# EAGLE schematic ControlInputs (EAGLE 7.5.0)
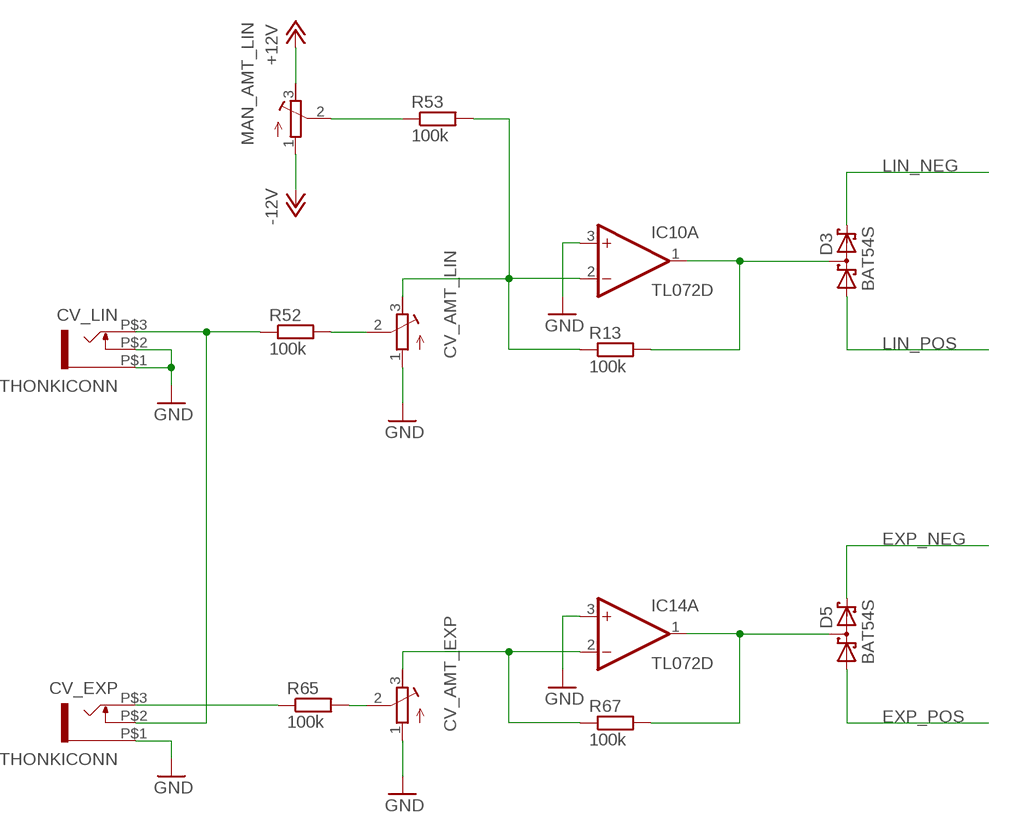
[diagram p0: schematic, sheet 1]

## Parts
CV_AMT_EXP  R-TRIMM64X  [RTRIM64X]
CV_AMT_LIN  R-TRIMM64X  [RTRIM64X]
CV_EXP  THONKICONN  [THONKICONN]
CV_LIN  THONKICONN  [THONKICONN]
D3  BAT54S  [SOT23]
D5  BAT54S  [SOT23]
IC10  TL072D  [SO08]
IC14  TL072D  [SO08]
MAN_AMT_LIN  R-TRIMM64X  [RTRIM64X]
R13  100k  R-EU_0603  [0603]
R52  100k  R-EU_0603  [0603]
R53  100k  R-EU_0603  [0603]
R65  100k  R-EU_0603  [0603]
R67  100k  R-EU_0603  [0603]

## Nets
+12V: MAN_AMT_LIN.3(E)
-12V: MAN_AMT_LIN.1(A)
EXP_NEG: D5.2(C2)
EXP_POS: D5.1(A1)
GND: CV_AMT_EXP.1(A) CV_AMT_LIN.1(A) CV_EXP.P$1 CV_LIN.P$1 CV_LIN.P$2 IC10.3(A:+IN) IC14.3(A:+IN)
LIN_NEG: D3.2(C2)
LIN_POS: D3.1(A1)
N$2: CV_AMT_LIN.3(E) IC10.2(A:-IN) R13.1 R53.2
N$7: CV_EXP.P$2 CV_LIN.P$3 R52.1
N$27: CV_AMT_LIN.2(S) R52.2
N$31: MAN_AMT_LIN.2(S) R53.1
N$58: CV_EXP.P$3 R65.1
N$59: D3.3(C1A2) IC10.1(A:OUT) R13.2
N$60: CV_AMT_EXP.2(S) R65.2
N$62: CV_AMT_EXP.3(E) IC14.2(A:-IN) R67.1
N$63: D5.3(C1A2) IC14.1(A:OUT) R67.2
Unconnected: IC10.5(B:+IN) IC10.6(B:-IN) IC10.7(B:OUT) IC14.5(B:+IN) IC14.6(B:-IN) IC14.7(B:OUT)

## Power pins joined to a net without a drawn wire
V+: IC10.8(P:V+) IC14.8(P:V+)
V-: IC10.4(P:V-) IC14.4(P:V-)

## Library data of the parts
CV_AMT_EXP CV_AMT_LIN MAN_AMT_LIN = resistor:R-TRIMM: Trimm resistor
CV_EXP CV_LIN = Rebel:THONKICONN
D3 D5 = diode:BAT54S: Schottky Diodes Pin connection corrected 2011-05-04 Source: Fairchild .. BAT54.pdf
IC10 IC14 = linear:TL072: OP AMP
R13 R52 R53 R65 R67 = Rebel:R-EU_: RESISTOR, European symbol